# EAGLE design TT7B v1.0 (EAGLE 7.7.0)
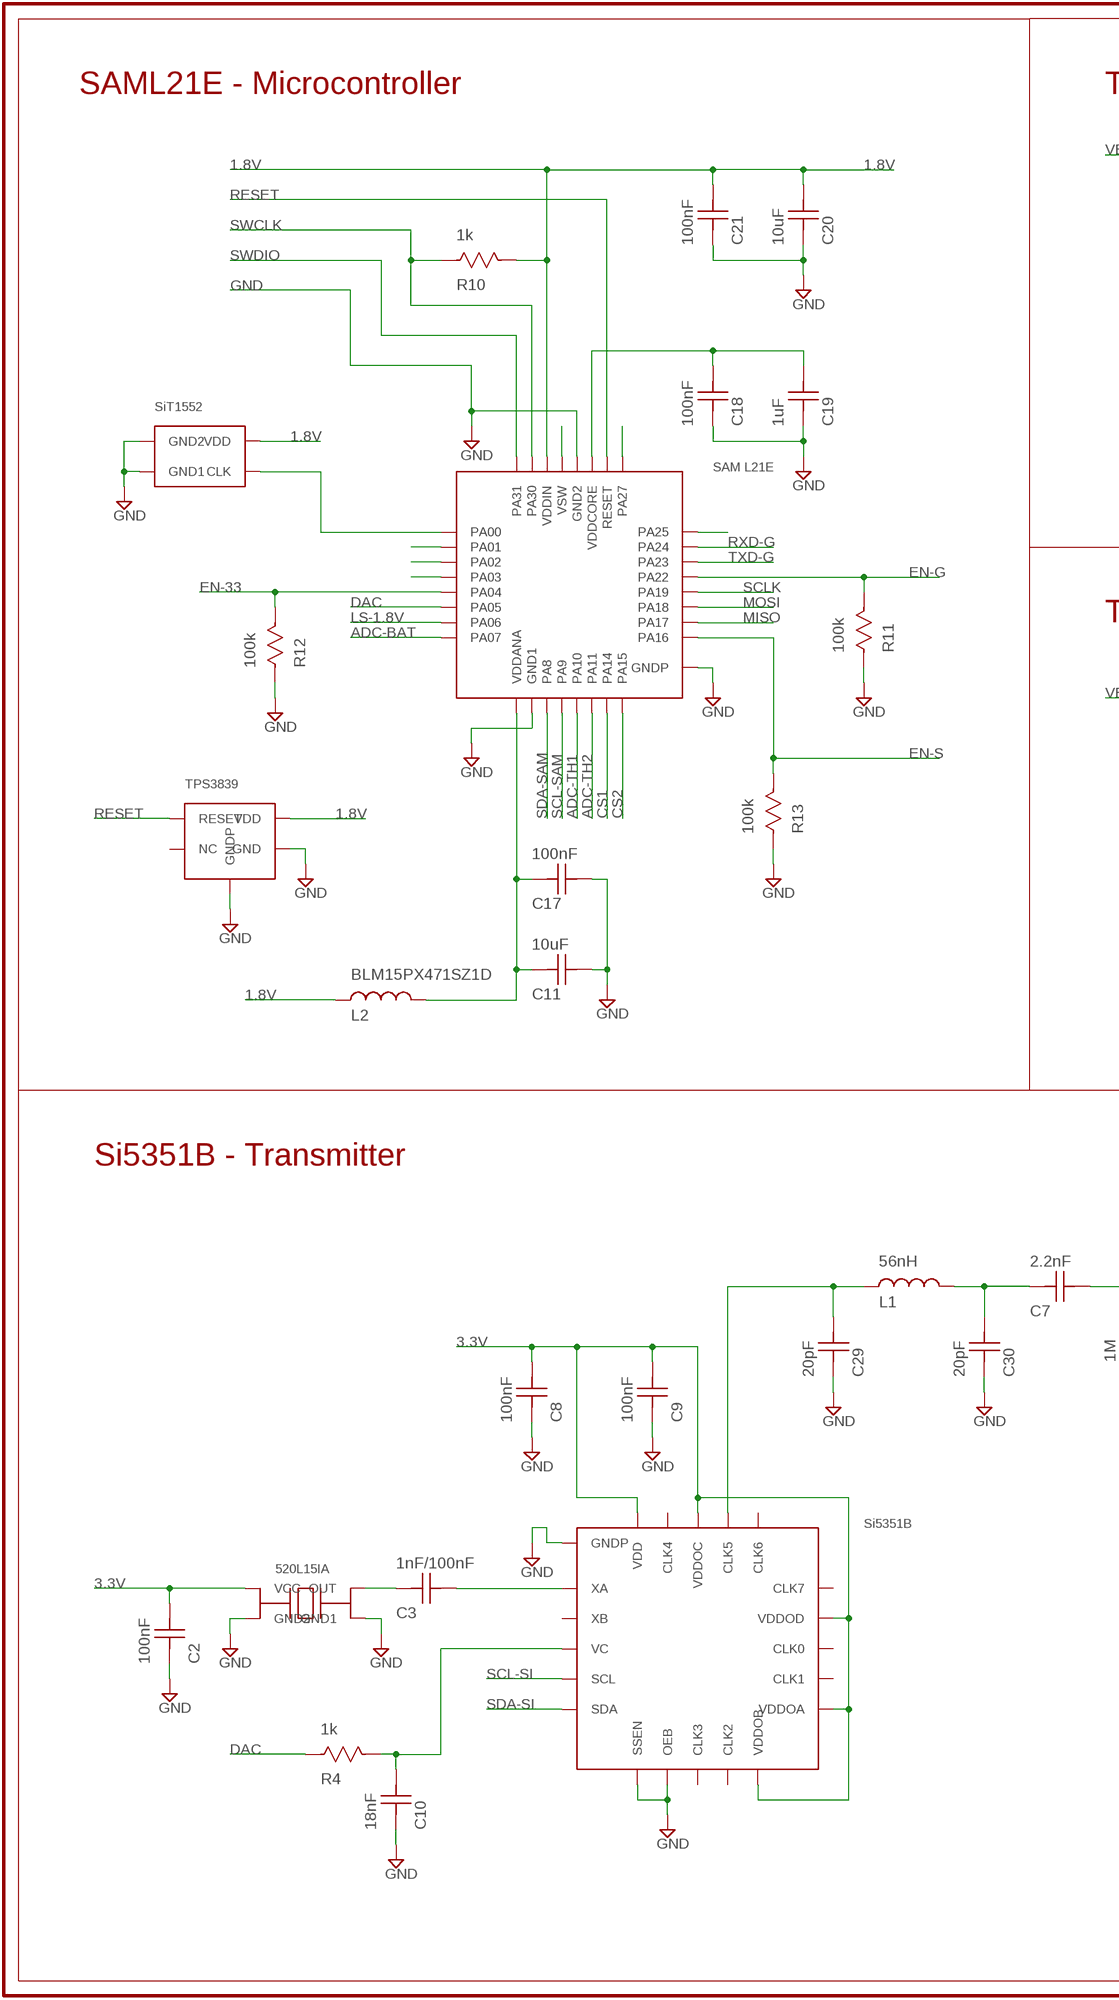
[diagram p0: schematic, sheet 1, part 1 of 2]
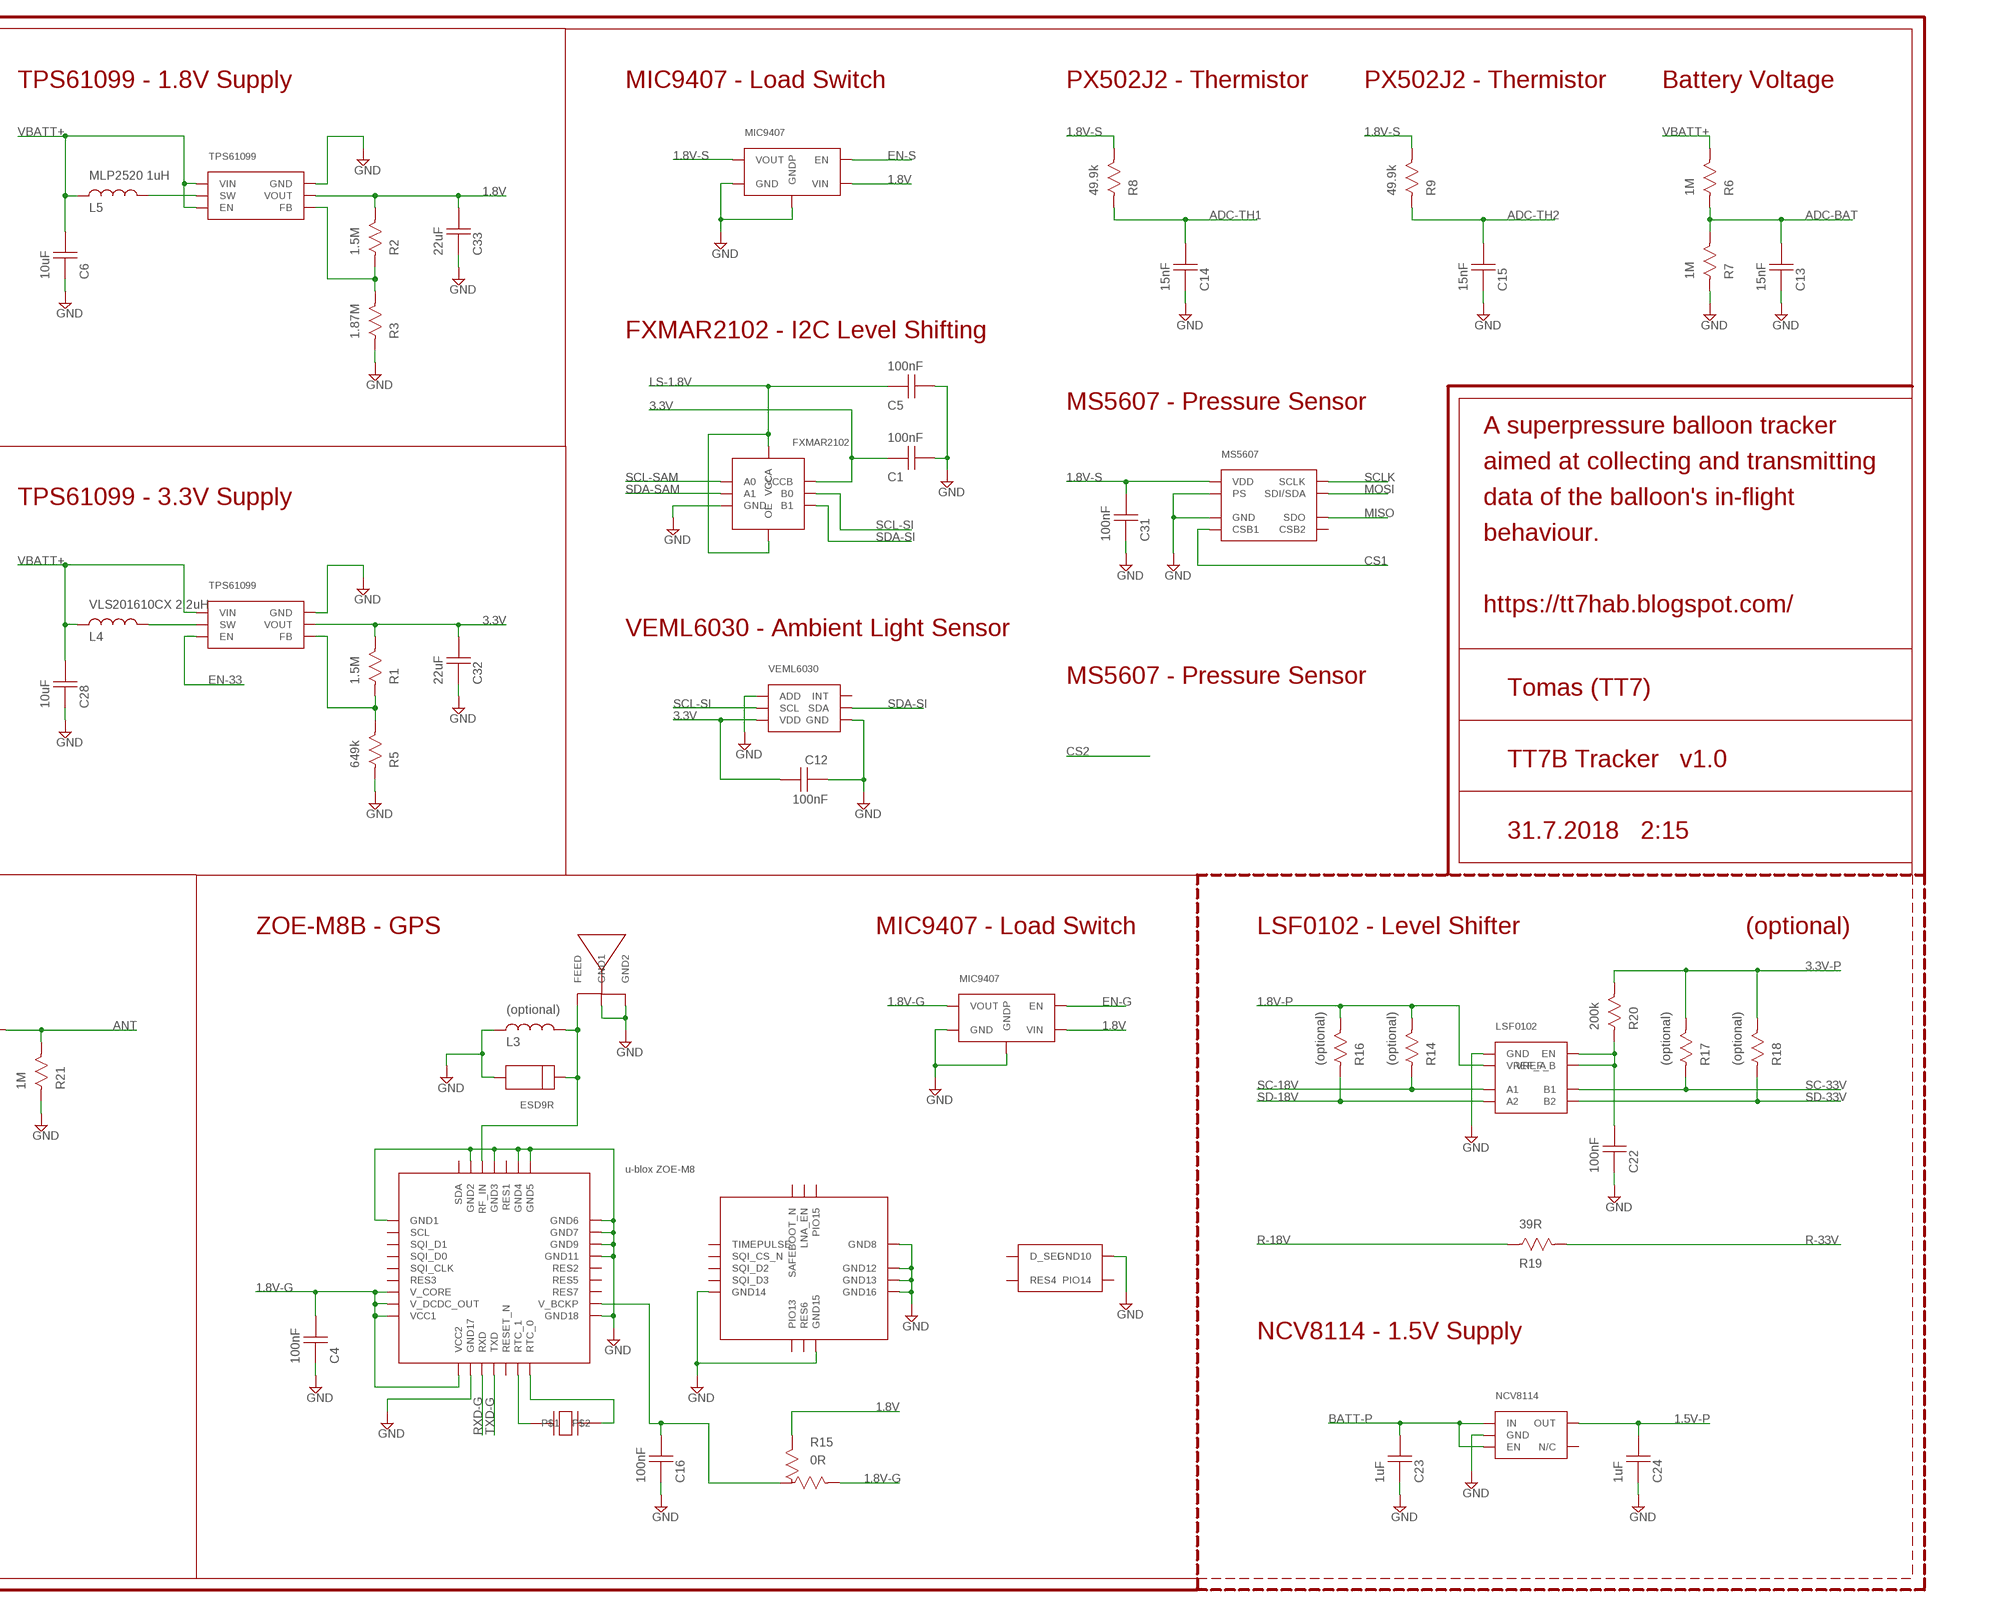
[diagram p1: schematic, sheet 1, part 2 of 2]

## Parts
C1  100nF  CAP0402  [CAP0402]
C2  100nF  CAP0402  [CAP0402]
C3  1nF/100nF  CAP0402  [CAP0402]
C4  100nF  CAP0402  [CAP0402]
C5  100nF  CAP0402  [CAP0402]
C6  10uF  CAP0402  [CAP0402]
C7  2.2nF  CAP0402  [CAP0402]
C8  100nF  CAP0402  [CAP0402]
C9  100nF  CAP0402  [CAP0402]
C10  18nF  CAP0402  [CAP0402]
C11  10uF  CAP0402  [CAP0402]
C12  100nF  CAP0402  [CAP0402]
C13  15nF  CAP0402  [CAP0402]
C14  15nF  CAP0402  [CAP0402]
C15  15nF  CAP0402  [CAP0402]
C16  100nF  CAP0402  [CAP0402]
C17  100nF  CAP0402  [CAP0402]
C18  100nF  CAP0402  [CAP0402]
C19  1uF  CAP0402  [CAP0402]
C20  10uF  CAP0402  [CAP0402]
C21  100nF  CAP0402  [CAP0402]
C22  100nF  CAP0402  [CAP0402]
C23  1uF  CAP0402  [CAP0402]
C24  1uF  CAP0402  [CAP0402]
C28  10uF  CAP0402  [CAP0402]
C29  20pF  CAP0402  [CAP0402]
C30  20pF  CAP0402  [CAP0402]
C31  100nF  CAP0402  [CAP0402]
C32  22uF  CAP0603  [CAP0603]
C33  22uF  CAP0603  [CAP0603]
D1  ESD9R  [ESD9R]
L1  56nH  IND0402  [IND0402]
L2  BLM15PX471SZ1D  IND0402  [IND0402]
L3  (optional)  IND0402  [IND0402]
L4  VLS201610CX 2.2uH  VLS201610CX  [VLS201610CX]
L5  MLP2520 1uH  MLP2520  [MLP2520]
R1  1.5M  RES0402  [RES0402]
R2  1.5M  RES0402  [RES0402]
R3  1.87M  RES0402  [RES0402]
R4  1k  RES0402  [RES0402]
R5  649k  RES0402  [RES0402]
R6  1M  RES0402  [RES0402]
R7  1M  RES0402  [RES0402]
R8  49.9k  RES0402  [RES0402]
R9  49.9k  RES0402  [RES0402]
R10  1k  RES0402  [RES0402]
R11  100k  RES0402  [RES0402]
R12  100k  RES0402  [RES0402]
R13  100k  RES0402  [RES0402]
R14  (optional)  RES0402  [RES0402]
R15  0R  RES0402-3  [RES0402-3]
R16  (optional)  RES0402  [RES0402]
R17  (optional)  RES0402  [RES0402]
R18  (optional)  RES0402  [RES0402]
R19  39R  RES0402  [RES0402]
R20  200k  RES0402  [RES0402]
R21  1M  RES0402  [RES0402]
U1  SAML21E18B-MUT  [SAML21E18B-MUT]
U2  UBLOX_ZOE-M8  [UBLOX_ZOE-M8]
U3  FXMAR2102  [FXMAR2102]
U4  520L15IA  [520L15IA]
U5  CM8V-T1A  [CM8V-T1A]
U6  MIC9407  [MIC9407]
U7  MS5607  [MS5607]
U8  LSF0102  [LSF0102]
U9  NCV8114  [NCV8114]
U10  W3011A  [W3011A]
U11  SI5351B  [SI5351B]
U12  TPS3839  [TPS383]
U13  MIC9407  [MIC9407]
U14  SIT1552  [SIT1552]
U15  VEML6030  [VEML6030]
U16  TPS61099  [TPS61099]
U17  TPS61099  [TPS61099]

## Nets
1.5V-P: C24.P$2 U9.OUT
1.8V: C20.P$2 C21.P$2 C33.P$2 L2.P$1 R2.P$2 R10.P$2 R15.1 U1.VDDIN U6.VIN U12.VDD U13.VIN U14.VDD U16.VOUT
1.8V-G: C4.P$2 R15.3 U2.V_CORE U2.V_DCDC_OUT U2.VCC1 U2.VCC2 U6.VOUT
1.8V-P: R14.P$2 R16.P$2 U8.VREF_A
1.8V-S: C31.P$2 R8.P$2 R9.P$2 U7.VDD U13.VOUT
3.3V: C1.P$1 C2.P$2 C8.P$2 C9.P$2 C12.P$2 C32.P$2 R1.P$2 U3.VCCB U4.VCC U11.VDD U11.VDDOA U11.VDDOB U11.VDDOC U11.VDDOD U15.VDD U17.VOUT
3.3V-P: R17.P$2 R18.P$2 R20.P$2
ADC-BAT: C13.P$2 R6.P$1 R7.P$2 U1.PA07
ADC-TH1: C14.P$2 R8.P$1 U1.PA10
ADC-TH2: C15.P$2 R9.P$1 U1.PA11
ANT: C7.P$2 R21.P$2
BATT-P: C23.P$2 U9.EN U9.IN
CS1: U1.PA14 U7.CSB1
CS2: U1.PA15
DAC: R4.P$1 U1.PA05
EN-33: R12.P$2 U1.PA04 U17.EN
EN-G: R11.P$2 U1.PA22 U6.EN
EN-S: R13.P$2 U1.PA16 U13.EN
GND: C1.P$2 C2.P$1 C4.P$1 C5.P$2 C6.P$1 C8.P$1 C9.P$1 C10.P$1 C11.P$2 C12.P$1 C13.P$1 C14.P$1 C15.P$1 C16.P$1 C17.P$2 C18.P$1 C19.P$1 C20.P$1 C21.P$1 C22.P$1 C23.P$1 C24.P$1 C28.P$1 C29.P$1 C30.P$1 C31.P$1 C32.P$1 C33.P$1 D1.2 L3.P$1 R3.P$1 R5.P$1 R7.P$1 R11.P$1 R12.P$1 R13.P$1 R21.P$1 U1.GND1 U1.GND2 U1.GNDP U2.GND1 U2.GND2 U2.GND3 U2.GND4 U2.GND5 U2.GND6 U2.GND7 U2.GND8 U2.GND9 U2.GND10 U2.GND11 U2.GND12 U2.GND13 U2.GND14 U2.GND15 U2.GND16 U2.GND17 U2.GND18 U3.GND U4.GND1 U4.GND2 U6.GND U6.GNDP U7.GND U7.PS U8.GND U9.GND U10.GND1 U10.GND2 U11.GNDP U11.OEB U11.SSEN U12.GND U12.GNDP U13.GND U13.GNDP U14.GND1 U14.GND2 U15.ADD U15.GND U16.GND U17.GND
LS-1.8V: C5.P$1 U1.PA06 U3.OE U3.VCCA
MISO: U1.PA17 U7.SDO
MOSI: U1.PA18 U7.SDI/SDA
N$1: D1.1 L3.P$2 U2.RF_IN U10.FEED
N$9: U1.PA25
N$10: C3.P$2 U11.XA
N$11: U1.PA01
N$12: U1.PA02
N$13: U1.PA03
N$15: U2.RTC_1 U5.P$1
N$18: U2.RTC_0 U5.P$2
N$19: C16.P$2 R15.2 U2.V_BCKP
N$21: U1.VSW
N$23: C18.P$2 C19.P$2 U1.VDDCORE
N$24: C22.P$2 R20.P$1 U8.EN U8.VREF_B
N$25: U1.PA27
N$26: C11.P$1 C17.P$1 L2.P$2 U1.VDDANA
N$34: C7.P$1 C30.P$2 L1.P$2
N$35: R2.P$1 R3.P$2 U16.FB
N$36: R1.P$1 R5.P$2 U17.FB
N$38: L4.P$2 U17.SW
N$39: L5.P$2 U16.SW
N$41: C29.P$2 L1.P$1 U11.CLK5
N$42: C3.P$1 U4.OUT
N$49: C10.P$2 R4.P$2 U11.VC
R-18V: R19.P$1
R-33V: R19.P$2
RESET: U1.RESET U12.RESET
RXD-G: U1.PA24 U2.RXD
SC-18V: R14.P$1 U8.A1
SC-33V: R17.P$1 U8.B1
SCL-SAM: U1.PA09(PA9) U3.A0
SCL-SI: U3.B0 U11.SCL U15.SCL
SCLK: U1.PA19 U7.SCLK
SD-18V: R16.P$1 U8.A2
SD-33V: R18.P$1 U8.B2
SDA-SAM: U1.PA08(PA8) U3.A1
SDA-SI: U3.B1 U11.SDA U15.SDA
SWCLK: R10.P$1 U1.PA30
SWDIO: U1.PA31
TXD-G: U1.PA23 U2.TXD
VBATT+: C6.P$2 C28.P$2 L4.P$1 L5.P$1 R6.P$2 U16.EN U16.VIN U17.VIN
XIN32: U1.PA00 U14.CLK
Unconnected: U2.D_SEL U2.LNA_EN U2.PIO13 U2.PIO14 U2.PIO15 U2.RES1 U2.RES2 U2.RES3 U2.RES4 U2.RES5 U2.RES6 U2.RES7 U2.RESET_N U2.SAFEBOOT_N U2.SCL U2.SDA U2.SQI_CLK U2.SQI_CS_N U2.SQI_D0 U2.SQI_D1 U2.SQI_D2 U2.SQI_D3 U2.TIMEPULSE U7.CSB2 U9.N/C U11.CLK0 U11.CLK1 U11.CLK2 U11.CLK3 U11.CLK4 U11.CLK6 U11.CLK7 U11.XB U12.NC U15.INT

## Notes on the sheet
- SAML21E - Microcontroller | TPS61099 - 1.8V Supply | MIC9407 - Load Switch | PX502J2 - Thermistor | PX502J2 - Thermistor | Battery Voltage
- FXMAR2102 - I2C Level Shifting
- MS5607 - Pressure Sensor
- A superpressure balloon tracker
- aimed at collecting and transmitting
- TPS61099 - 3.3V Supply | data of the balloon's in-flight
- behaviour.
- https://tt7hab.blogspot.com/
- VEML6030 - Ambient Light Sensor
- MS5607 - Pressure Sensor
- Tomas (TT7)
- TT7B Tracker   v1.0
- 31.7.2018   2:15
- Si5351B - Transmitter | ZOE-M8B - GPS | MIC9407 - Load Switch | LSF0102 - Level Shifter | (optional)
- NCV8114 - 1.5V Supply

## Library data of the parts
C1-C24 C28-C31 = TT7:CAP0402: CAPACITOR 0402 - 1 x 0.5 x 0.35mm
C32 C33 = TT7:CAP0603: CAPACITOR 0603 - 1.55 x 0.85 x 0.45mm
D1 = TT7:ESD9R: ESD9R protection diode footprint.
L1-L3 = TT7:IND0402: INDUCTOR 0402 - 1 x 0.5 x 0.35mm
L4 = TT7:VLS201610CX: VLS201610CX inductor footprint.
L5 = TT7:MLP2520: MLP2520 inductor footprint.
R1-R14 R16-R21 = TT7:RES0402: RESISTOR 0402 - 1 x 0.5 x 0.35mm
R15 = TT7:RES0402-3: Resistor Switch.
U1 = TT7:SAML21E18B-MUT: Atmel's SAM L21E18B in a 32 pin QFN package.
U2 = TT7:UBLOX_ZOE-M8: U-blox ZOE-M8 footprint.
U3 = TT7:FXMAR2102: FXMAR2102 voltage translator in UMLP-8 package footprint.
U4 = TT7:520L15IA: 520L15IA TCXO footprint.
U5 = TT7:CM8V-T1A: CM8V-T1A 32.768kHz crystal footprint.
U6 U13 = TT7:MIC9407: MIC9407 load switch in MLF package footprint.
U7 = TT7:MS5607: MS5607 barometric pressure sensor footprint.
U8 = TT7:LSF0102: LSF0102 bidirectional level translator in VSSOP package (LSF0102DCUR).
U9 = TT7:NCV8114: NCV8114 LDO regulator footprint in TSOP-5 package.
U10 = TT7:W3011A: W3011A GPS chip antenna footprint.
U11 = TT7:SI5351B: Si5351B transmitter.
U12 = TT7:TPS3839: TPS3839 in X2SON-4 package footprint.
U14 = TT7:SIT1552: SiT1552 32kHz TCXO footprint.
U15 = TT7:VEML6030: VEML6030 ambient light sensor footprint.
U16 U17 = TT7:TPS61099: TPS61099 boost converter in DSBGA package footprint.

## Board
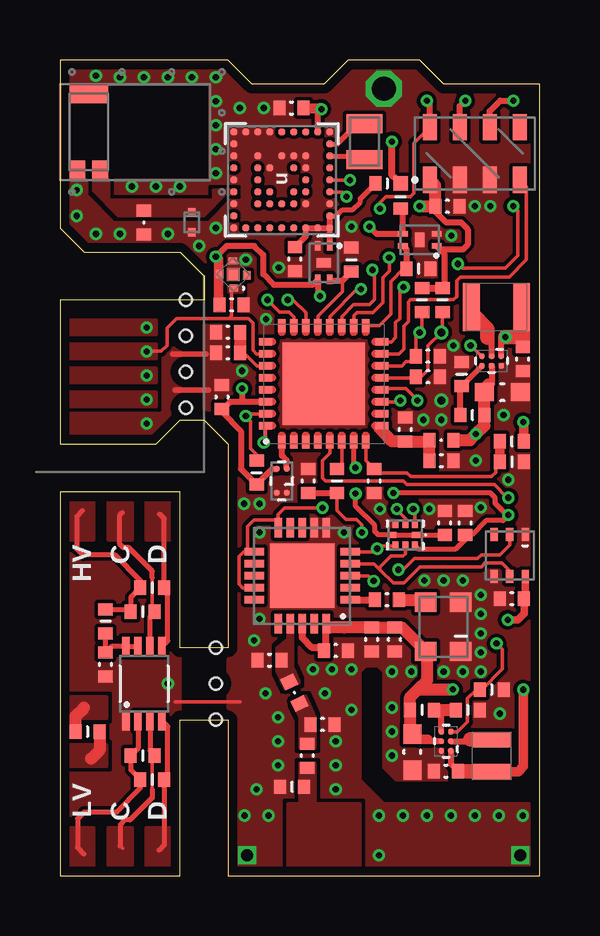
[diagram p2: board, top side]
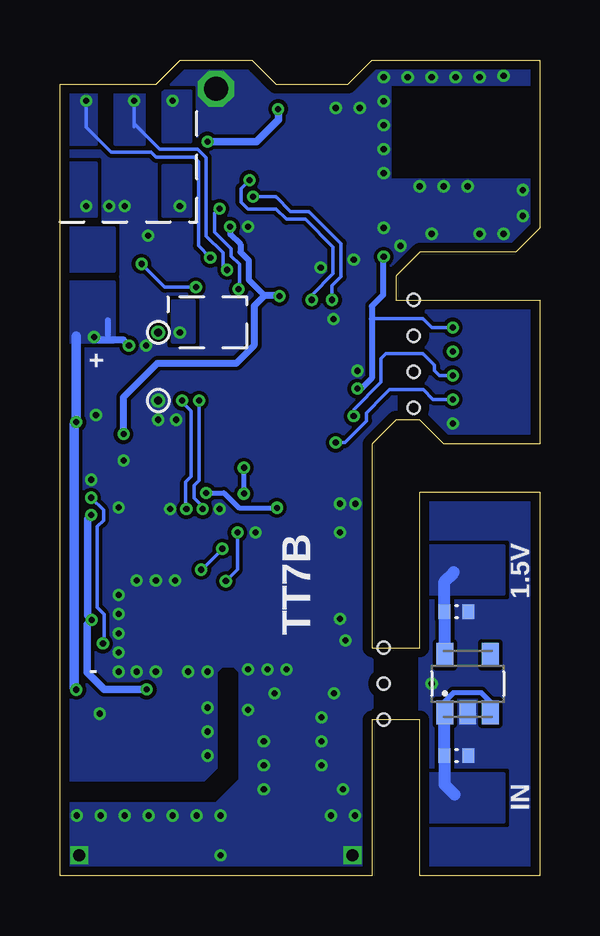
[diagram p3: board, bottom side, seen from below]

Size 20 x 34 mm. Coordinates in mm from the lower left corner, seen from the top.
Outline: 7,0 20,0 20,33 16,33 15,34 12,34 11,33 8,33 7,34 0,34 0,27 1,26 5,26 6,25 6,24 0,24 0,18 4,18 5,19 6,19 7,18 7,9.5 5,9.5 5,16 0,16 0,0 5,0 5,6.5 7,6.5 7,0
Copper layers (1*16): Top 0.035559375mm / dielectric 1.6mm / Bottom 0.035559375mm
Design rules "oshpark-2layer *": minimum track width 6mil, minimum drill 10mil, track to track 6mil, track to pad 6mil, pad to pad 6mil, via to via 6mil, smd to smd 0mil, copper to edge 15mil, drill to drill 6mil, minimum pad ring 5mil, minimum via ring 5mil, stop-mask expansion 0mil, vias tented up to drill 20mil, thermal gap 10mil
Holes 0.51 mm at 5.25,19.5 5.25,21 5.25,22.5 5.25,24 6.5,9.5 6.5,8 6.5,6.5

### Footprints (pad centres in the part's own frame; a part is rotated, then mirrored left to right if it is on the bottom)
CAP0402 = smd 0.5 x 0.6: P$1 -0.5,0; P$2 0.5,0
CAP0603 = smd 0.8 x 0.75: P$1 -0.75,0; P$2 0.75,0
ESD9R = smd 0.36 x 0.3: 1 -0.42,0; 2 0.42,0
IND0402 = smd 0.5 x 0.6: P$1 -0.5,0; P$2 0.5,0
VLS201610CX = smd 0.65 x 1.6: P$1 -0.675,0; P$2 0.675,0
MLP2520 = smd 0.7 x 2: P$1 -1.05,0; P$2 1.05,0
RES0402 = smd 0.5 x 0.6: P$1 -0.5,0; P$2 0.5,0
RES0402-3 = smd 0.6 x 0.5: 1 -0.55,1.05 | smd 0.6 x 0.6: 2 -0.55,0 | smd 0.5 x 0.6: 3 0.5,0
SAML21E18B-MUT = smd 0.3 x 0.55: GND1 -1.25,-2.425; GND2 0.25,2.425; PA08 -0.75,-2.425; PA09 -0.25,-2.425; PA10 0.25,-2.425; PA11 0.75,-2.425; PA14 1.25,-2.425; PA15 1.75,-2.425; PA27 1.75,2.425; PA30 -1.25,2.425; PA31 -1.75,2.425; RESET 1.25,2.425; VDDANA -1.75,-2.425; VDDCORE 0.75,2.425; VDDIN -0.75,2.425; VSW -0.25,2.425 | smd 3.45 x 3.45: GNDP 0,0 | smd 0.55 x 0.3: PA00 -2.425,1.75; PA01 -2.425,1.25; PA02 -2.425,0.75; PA03 -2.425,0.25; PA04 -2.425,-0.25; PA05 -2.425,-0.75; PA06 -2.425,-1.25; PA07 -2.425,-1.75; PA16 2.425,-1.75; PA17 2.425,-1.25; PA18 2.425,-0.75; PA19 2.425,-0.25; PA22 2.425,0.25; PA23 2.425,0.75; PA24 2.425,1.25; PA25 2.425,1.75
UBLOX_ZOE-M8 = smd 0.27 x 0.27: D_SEL -0.5,0.5; GND1 -2,2; GND2 -1,2; GND3 0,2; GND4 1,2; GND5 1.5,2; GND6 2,2; GND7 2,1.5; GND8 1,1; GND9 2,1; GND10 0.5,0.5; GND11 2,0.5; GND12 1,0; GND13 1,-0.5; GND14 -1,-1; GND15 0.5,-1; GND16 1,-1; GND17 -1,-2; GND18 2,-2; LNA_EN 0,1; PIO13 -0.5,-1; PIO14 0.5,-0.5; PIO15 0.5,1; RES1 0.5,2; RES2 2,0; RES3 -2,-0.5; RES4 -0.5,-0.5; RES5 2,-0.5; RES6 0,-1; RES7 2,-1; RESET_N 0.5,-2; RF_IN -0.5,2; RTC_0 1.5,-2; RTC_1 1,-2; RXD -0.5,-2; SAFEBOOT_N -0.5,1; SCL -2,1.5; SDA -1.5,2; SQI_CLK -2,0; SQI_CS_N -1,0.5; SQI_D0 -2,0.5; SQI_D1 -2,1; SQI_D2 -1,0; SQI_D3 -1,-0.5; TIMEPULSE -1,1; TXD 0,-2; V_BCKP 2,-1.5; V_CORE -2,-1; V_DCDC_OUT -2,-1.5; VCC1 -2,-2; VCC2 -1.5,-2
FXMAR2102 = smd 0.25 x 0.35: A0 -0.405,-0.455; A1 0,-0.455; B0 0,0.455; B1 0.405,0.455; GND 0.405,-0.455; VCCB -0.405,0.455 | smd 0.35 x 0.25: OE 0.55,0 | smd 0.45 x 0.25: VCCA -0.5,0
520L15IA = smd 0.8 x 0.9: GND1 1.025,-0.725; GND2 -1.025,-0.725; OUT 1.025,0.725; VCC -1.025,0.725
CM8V-T1A = smd 0.8 x 1.5: P$1 -0.75,0; P$2 0.75,0
MIC9407 = smd 0.23 x 0.4: EN -0.25,0.7; GND 0.25,-0.7; VIN 0.25,0.7; VOUT -0.25,-0.7 | smd 0.6 x 0.4: GNDP 0,0
MS5607 = smd 1.1 x 0.6: CSB1 -1.1,-1.875; CSB2 1.1,-1.875; GND -1.1,-0.625; PS -1.1,0.625; SCLK 1.1,1.875; SDI/SDA 1.1,0.625; SDO 1.1,-0.625; VDD -1.1,1.875
LSF0102 = smd 0.3 x 0.8: A1 0.25,-1.55; A2 0.75,-1.55; B1 0.25,1.55; B2 0.75,1.55; EN -0.75,1.55; GND -0.75,-1.55; VREF_A -0.25,-1.55; VREF_B -0.25,1.55
NCV8114 = smd 0.7 x 1: EN -0.95,1.2; GND 0,1.2; IN 0.95,1.2; N/C -0.95,-1.2; OUT 0.95,-1.2
W3011A = smd 0.65 x 0.8: FEED -1.325,-1.6; GND2 -2.275,-1.6 | smd 1.6 x 0.8: GND1 -1.8,1.6
SI5351B = smd 0.8 x 0.3: CLK0 2,0; CLK1 2,-0.5; CLK7 2,1; SCL -2,-0.5; SDA -2,-1; VC -2,0; VDDOA 2,-1; VDDOD 2,0.5; XA -2,1; XB -2,0.5 | smd 0.3 x 0.8: CLK2 0.5,-2; CLK3 0,-2; CLK4 -0.5,2; CLK5 0.5,2; CLK6 1,2; OEB -0.5,-2; SSEN -1,-2; VDD -1,2; VDDOB 1,-2; VDDOC 0,2 | smd 2.7 x 2.7: GNDP 0,0
TPS383 = smd 0.35 x 0.3 rotated 45: GND 0.42,-0.38; RESET -0.42,0.38 | smd 0.53 x 0.53 rotated 45: GNDP 0,0 | smd 0.3 x 0.35 rotated 45: NC -0.42,-0.38; VDD 0.42,0.38
SIT1552 = smd 0.25 x 0.25: CLK 0.5,-0.205; GND1 -0.5,-0.205; GND2 -0.5,0.205; VDD 0.5,0.205
VEML6030 = smd 0.55 x 0.3: ADD -0.875,0.65; GND 0.875,-0.65; INT 0.875,0.65; SCL -0.875,0; SDA 0.875,0; VDD -0.875,-0.65
TPS61099 = smd 0.23 x 0.23: EN -0.2,-0.4; FB 0.2,-0.4; GND 0.2,0.4; SW -0.2,0; VIN -0.2,0.4; VOUT 0.2,0

### Placement (x,y rotation side)
C1  16.9,14.7 90 top
C2  13.95,9.84 90 top
C3  13.63,11.5 180 top
C4  9.8,25.7 90 top
C5  16.05,14.7 90 top
C6  19.3,21.53 90 top
C7  10.31,5 270 top
C8  11.5,9.38 180 top
C9  13,9.84 90 top
C10  10.35,16.45 270 top
C11  15.9,17.3 0 top
C12  18.85,11.55 0 top
C13  13.11,16.45 90 top
C14  15.35,20.8 180 top
C15  15.35,21.65 180 top
C16  9.65,32 0 top
C17  14.4,18.6 90 top
C18  7,21.8 0 top
C19  7,22.65 0 top
C20  7.16,23.79 180 top
C21  6.75,19.95 270 top
C22  1.9,8.8 90 top
C23  3.46,5 180 bottom
C24  3.46,11 180 bottom
C28  16.1,4.35 0 top
C29  8.73,8.97 0 top
C30  10.95,6.3 180 top
C31  16.15,27.9 180 top
C32  14.7,5.15 90 top
C33  18.45,20.15 180 top
D1  5.5,27.23 270 top
L1  9.78,7.62 295.5 top
L2  15.9,18.15 180 top
L3  3.5,27.22 90 top
L4  18,5 90 top
L5  18.2,23.7 180 top
R1  15.1,6.9 180 top
R2  17.2,19.2 0 top
R3  16.75,20.9 270 top
R4  1kΩ  [RES0402]  11.55,16.45 270 top
R5  17,6.9 180 top
R6  18.85,18.1 0 top
R7  18.85,17.25 180 top
R8  15.95,24 90 top
R9  15.1,24 90 top
R10  8.2,16.8 270 top
R11  12.15,25.68 270 top
R12  18,7.75 180 top
R13  14.95,25.3 180 top
R14  3.45,5 180 top
R15  0Ω  [RES0402-3]  13.65,28.85 180 top
R16  3.85,4 180 top
R17  3.45,11 180 top
R18  3.85,12 180 top
R19  1.15,6 180 top
R20  1.9,10.6 90 top
R21  1MΩ  [RES0402]  9.68,3.7 0 top
U1  11,20.5 90 top
U2  9.25,29 90 top
U3  14.4,14.2 180 top
U4  15.98,10.38 90 top
U5  12.7,30.6 90 top
U6  11,25.55 180 top
U7  17.3,30.1 90 top
U8  3.5,8 0 top
U9  3,8 180 bottom
U10  3,31 0 top
U11  10.1,12.5 180 top
U12  7.23,25.05 135 top
U13  15,26.5 90 top
U14  9.25,16.45 90 top
U15  18.75,13.35 90 top
U16  18,21.45 270 top
U17  16.1,5.6 180 top

### Tracks (layer width: path | path; a pad name or v marks a point on that pad's centre or on a via)
1.5V-P
  Bottom 0.5: U9.OUT C24.P$2 3.96,12.26 3.58,12.64
  pour Bottom (no thermals): 5,11.75 1.5,11.75 1.5,13.75 5,13.75
1.8V  (via drill 0.25 pad 0.25)
  Top 0.152: 6.61,25.03 U12.VDD
  Top 0.24: U16.VOUT 18,20.45 C33.P$2 | R15.1 14.3,27.7 U13.VIN 13.2,26.75 v12.9,27.05 | v10.85,24.15 10.75,24.25 U6.VIN 10.52,24.62 8.92,24.62 8.48,25.07 8.48,25.87 8.1,26.25 6.95,26.25 v6.5,25.8
  Top 0.25: U1.VDDIN 7.59,19.75 | 7.59,19.75 7.1,19.75 6.8,19.45 C21.P$2 | 6.8,19.4 C21.P$2 | v7.6,20.3 7.6,19.76 7.59,19.75 | U14.VDD 8.85,16.95 R10.P$2 7.55,16.95 7.55,18.51 6.75,19.31 C21.P$2
  Top 0.39: 6.61,23.83 6.61,25.03 6.61,25.69 v6.5,25.8
  Top 0.4: C20.P$2 6.61,23.83
  Top 0.5: L2.P$1 17.1,18.15 v17.35,18.4 17.7,18.75 R2.P$2 C33.P$2 17.87,20.48
  Bottom 0.152: v3.62,22.85 4.49,22.85 4.86,23.22 6.99,23.22
  Bottom 0.24: v12.9,27.05 12.9,26.74 12.48,26.31 12.48,25.99 12.13,25.65 12.13,24.84 11.5,24.21 11.5,24.15
  Bottom 0.25: v7.6,20.3 7.43,20.3 6.99,20.73 6.99,23.22 6.99,23.73 6.52,24.2 6.52,25.78 v6.5,25.8
  Bottom 0.3: v17.35,18.4 17.35,19.95 15.94,21.36 12.64,21.36 11.89,22.12 11.89,23.76 11.5,24.15 | 11.5,24.21 10.91,24.21 v10.85,24.15
  pour Top: 0,23.15 4,23.15 4,22.55 0,22.55
1.8V-G
  Top 0.2: U2.VCC2 11.54,27.5 11.79,27.75 12.2,27.75 12.52,28.08 12.52,28.22 R15.3
  Top 0.24: U6.VOUT U2.VCC1 | C4.P$2 10.25,26.65 U2.V_CORE
  Top 0.25: U2.V_CORE U2.V_DCDC_OUT U2.VCC1 U2.VCC2
1.8V-P
  Top 0.2: U8.VREF_A 3.25,5.3 R14.P$2 2.95,4.4 R16.P$2 3.35,3.65 2.35,2.65 1.01,2.65 0.73,2.37 0.73,1.16 1,0.89
  pour Top (no thermals): 0,2 1.4,2 1.4,0 0,0
1.8V-S  (via drill 0.25 pad 0.25)
  Top 0.24: C31.P$2 15.65,27.68 16.1,27.23 16.72,27.23 17.01,26.94 17.01,26.3 16.81,26.1 15.85,26.1 U13.VOUT 16.05,25.91 16.05,24.59 R8.P$2
  Top 0.3: R9.P$2 R8.P$2
  Top 0.5: U7.VDD 15.65,28.77 C31.P$2 v15,27.9
  pour Bottom (no thermals): 14.55,29.6 15.7,29.6 15.7,27.5 14.55,27.5
3.3V  (via drill 0.25 pad 0.25)
  Top 0.152: U11.VDDOD 7.62,12 7.46,12.16 7.46,13.31 7.65,13.5 U11.VDDOA 7.82,13.5 7.82,14.54 8.09,14.81 9.1,14.81 | 9.1,14.81 U11.VDDOB | 9.1,14.81 9.1,15.06 9.37,15.33 v10.95,15.33
  Top 0.2: U3.VCCB 14.93,13.62 16.5,13.62 16.9,14.02 C1.P$1 17.17,14.2 17.77,14.8 18.47,14.8 v18.7,15.03 18.64,15.03 18.15,15.51 18.15,15.74 17.94,15.95 v13.9,15.95
  Top 0.24: U17.VOUT 15.41,5.6
  Top 0.25: 15.41,5.6 15.34,5.68
  Top 0.3: 11.26,10.34 U11.VDD 11.1,9.48 arc-90 C8.P$2 10.86,9.52 10.5,9.52 10.1,9.92 U11.VDDOC
  Top 0.305: v18.67,10.66 19.09,10.66 19.36,10.93 19.36,11.54 C12.P$2 19.4,11.6 U15.VDD
  Top 0.4: C32.P$2 14.92,5.68 15.34,5.68
  Top 0.5: C32.P$2 14.6,6 R1.P$2 14.6,7.43 14.93,7.76 | 14.93,7.76 15.31,8.14 15.31,9.29 U4.VCC 14.27,10.34 C2.P$2 C9.P$2 11.86,10.34 11.26,10.34 | 14.93,7.76 v16.39,7.76
  Bottom 0.2: v13.9,15.95 13.16,15.95 12.54,15.33 v10.95,15.33
  Bottom 0.305: v16.39,7.76 18.16,7.76 18.86,8.46 18.86,10.47 v18.67,10.66 18.85,10.84 18.85,14.87 v18.7,15.03
3.3V-P
  Top 0.2: R20.P$2 2.85,11.1 R17.P$2 2.95,11.6 R18.P$2 3.35,12.31 2.3,13.36 0.96,13.36 0.71,13.61 0.71,14.98 0.95,15.21
  pour Top (no thermals): 1.4,14 1.4,16 0,16 0,14
ADC-BAT
  Top 0.152: U1.PA07 12.75,17.31 C13.P$2 13.27,16.79 14.48,16.79 14.64,16.63 18,16.63 18.18,16.81 18.18,17.12 R7.P$2
  Top 0.4: R7.P$2 R6.P$1
ADC-TH1  (via drill 0.33 pad 0.33)
  Top 0.152: U1.PA10 14.8,20.75 C14.P$2 15.08,20.8 15.35,21.07 15.35,22.09 v15.9,22.64 15.95,22.69 R8.P$1
ADC-TH2  (via drill 0.25 pad 0.25)
  Top 0.152: U1.PA11 14.25,21.25 14.42,21.42 14.62,21.42 C15.P$2 14.85,22.49 v15,22.64 15.1,22.74 R9.P$1
  pour Bottom (no thermals): 14.4,22.25 14.4,23.94 15.3,23.94 15.3,22.25
ANT
  pour Top (no thermals): 10,4.67 10.63,4.67 10.63,3 12.5,3 12.5,0 9.5,0 9.5,3 10,3
BATT-P
  Bottom 0.2: U9.EN 2.05,7.25 2.43,7.62 3.6,7.62 3.95,7.27 U9.IN
  Bottom 0.5: U9.IN C23.P$2 3.96,3.8 3.54,3.37
  pour Bottom: 5,4.25 1.5,4.25 1.5,2.25 5,2.25
CS1
  Top 0.152: U1.PA14 14.14,21.75 14.34,21.95 14.34,22.9 14.53,23.09 14.53,23.91 14.62,24 16.41,24 16.55,24.13 16.55,24.8 16.7,24.95 18.73,24.95 19.46,25.68 19.46,28.72 U7.CSB1
CS2  (via drill 0.25 pad 0.25)
  Top 0.152: U1.PA15 13.82,22.25 13.98,22.42 13.98,23.04 14.17,23.23 14.17,24.37 v14.33,24.53 | v18.9,27.9 19.09,27.71 19.09,25.83 18.58,25.32 16.77,25.32 v16.6,25.5
  Bottom 0.152: v14.33,24.53 15.63,24.53 v16.6,25.5
  pour Bottom (no thermals): 18.5,29.7 19.7,29.7 19.7,27.5 18.5,27.5
DAC
  Top 0.152: U1.PA05 11.75,16.95 R4.P$1
EN-33  (via drill 0.25 pad 0.25)
  Top 0.152: U17.EN 16.58,6 16.99,6.41 16.99,7.38 17.36,7.75 R12.P$2 17.59,7.75 18.46,8.62 18.46,9.43 v18.21,9.68 | U1.PA04 11.25,17.61 10.94,17.3 10.94,16.58 11.07,16.45 14.32,16.45 14.48,16.29 18.12,16.29 18.66,15.75 v18.7,15.75
  Bottom 0.152: v18.21,9.68 18.16,9.72 18.16,10.88 18.45,11.17 18.45,14.55 18.19,14.81 18.19,15.24 v18.7,15.75 | v18.7,15.75
EN-G
  Top 0.152: U1.PA22 10.75,23.32 11.77,24.34 11.77,24.8 | 11.3,24.8 U6.EN
  Top 0.24: 11.3,24.8 11.77,24.8 R11.P$2
EN-S
  Top 0.152: U1.PA16 13.32,22.93 13.8,23.4 13.8,24.77 14.32,25.3 R13.P$2
  Top 0.24: U13.EN 14.45,26.1 R13.P$2
GND  (via drill 0.25, 0.33, 0.5, 1)
  Top 0.152: 4.8,7.25 7.5,7.25
  Top 0.22: 6.2,20.25 4.8,20.25 | 6.1,21.75 4.7,21.75
  other vias: 4.5,26.75 2.5,26.75 4.5,33.28 6.5,33.28 1.5,33.35 2.5,33.28 0.7,28.58 3,28.73 5,28.73 6.5,31.28 6.5,32.28 0.7,27.5 6.5,27 15.9,19.8 13.5,32.8 7.8,0.85 8.32,14.3 8.32,10.7 3.62,18.85 1.5,26.75 4,28.73 7.5,32 6.5,30.28 3.5,33.28 5.5,33.28 6.5,29.28 17.55,9.3 17.55,10.9 17.55,11.7 17.55,10.1 13.85,5 8.7,2.5 16.8,8.5 13.85,8.5 8.2,3.6 9.1,4.6 9.1,5.6 9.1,6.6 19.2,0.85 7.7,2.5 19.3,2.5 18.3,2.5 17.3,2.5 16.3,2.5 15.3,2.5 14.3,2.5 13.3,2.5 13.3,0.85 11.5,3.6 11.5,4.6 11.5,5.6 12.15,6.9 8.57,7.6 8.1,9.8 11.05,7.6 10.55,8.6 12.15,8.6 11.35,8.6 14.65,8.5 16,8.5 17.55,8.5 13.85,6 13.85,7 8.5,32 17.3,27.9 16.8,12.3 16,12.3 15.2,12.3 7.67,15.5 8.32,15.5 11.85,14.3 18.35,6.75 18.7,16.5 13.35,15.28 17.55,15.35 9.12,25.35 15.15,19 7.6,21.04 18.5,19.2 15.4,15.28 17.35,17.3 5.8,26.25 16.32,26.68 12.15,27.05 15.9,19 17.95,27.9 16.41,22.1 7.75,25.68 8.6,23.2 4.5,8
  pour Top (rank 2, no thermals): 7.5,25 0,25 0,29 6.25,29 6.25,33 0,33 0,34 7.5,34
  pour Bottom (rank 2, no thermals): 7.5,25 0,25 0,29 6.25,29 6.25,33 0,33 0,34 7.5,34
  pour Top (rank 2, no thermals): 7,0 20,0 20,3 13.5,3 12.5,4 12.5,8.5 12.75,8.75 13.25,8.75 13.5,8.5 13.5,4.5 14,4 20,4 20,33 16,33 15,34 12,34 11,33 8,33 7,34 7,26 6,26 6,18 7,18
  pour Bottom (rank 2, no thermals): 7,0 20,0 20,3 13.5,3 12.5,4 12.5,8.5 12.75,8.75 13.25,8.75 13.5,8.5 13.5,4.5 14,4 20,4 20,33 16,33 15,34 12,34 11,33 8,33 7,34 7,26 6,26 6,18 7,18
  pour Top (rank 2, no thermals): 5,18 0,18 0,24 5,24
  pour Bottom (rank 2, no thermals): 0,18 0,24 5,24 5,18
  pour Bottom (rank 2, no thermals): 5,0 5,16 0,16 0,0
  pour Top (rank 2, no thermals): 0,0 5,0 5,16 0,16
LS-1.8V  (via drill 0.25 pad 0.25)
  Top 0.2: C5.P$1 U3.VCCA U3.OE 13.27,14.2 13.13,14.35 13.13,14.59 12.33,15.39 v12.33,15.92 | v12.33,17 12.25,17.08 U1.PA06
  Bottom 0.2: v12.33,15.92 v12.33,17
MISO  (via drill 0.25 pad 0.25)
  Top 0.152: v13.73,25.76 13.73,25.19 13.46,24.92 13.46,23.88 13.05,23.47 12.38,23.47 12.25,23.34 U1.PA17
  Top 0.25: U7.SDO 17.93,31.87 18.36,32.31 v18.89,32.31 v18.9,32.3
  Bottom 0.152: v18.9,32.3 18.9,31.2 17.86,30.16 16.2,30.16 15.98,29.94 14.41,29.94 14.23,29.75 14.23,26.26 v13.73,25.76
  pour Bottom (no thermals): 18.5,32.7 19.7,32.7 19.7,30.5 18.5,30.5
MOSI  (via drill 0.25 pad 0.25)
  Top 0.152: v13.03,25.25 13.12,25.16 13.12,24.02 12.9,23.8 12.24,23.8 11.75,23.31 U1.PA18
  Top 0.25: U7.SDI/SDA 16.68,32.08 v16.9,32.3
  Bottom 0.152: 16.9,31.22 v16.9,32.3 16.9,31.34 15.83,30.27 14.26,30.27 13.9,29.92 13.9,26.67 13.21,25.97 13.21,25.43 v13.03,25.25
  pour Bottom (no thermals): 17.7,32.7 17.7,30.5 16.5,30.5 16.5,32.7
N$1
  pour Top (no thermals): 2.43,27.52 6,27.52 6.9,28.43 6.7,28.57 6.4,28.57 6.4,28.16 2.05,28.16 1.98,28.55 1.4,28.55
  pour Top: 1.4,28.55 1.4,29 2.04,29 2.04,28.15
  pour Top: 6.5,28.57 7.33,28.57 7.33,28.43 6.5,28.43
N$10
  Top 0.3: U11.XA C3.P$2
N$15
  Top 0.2: U2.RTC_1 12.55,30 U5.P$1
N$18
  Top 0.2: U2.RTC_0 11.55,30.5 12.07,31.02 U5.P$2
N$19  (via drill 0.25 pad 0.25)
  Top 0.25: U2.V_BCKP 10.75,31.8 v10.9,31.95
  Top 0.3: 14.05,29 13.85,29.2 v13.85,30.6
  Top 0.305: R15.2 14.05,29
  Top 0.406: C16.P$2 10.85,32 v10.9,31.95
  Bottom 0.2: 10.89,31.94 v10.9,31.95
  Bottom 0.305: v13.85,30.6 11.8,30.6 10.89,31.51 10.89,31.94
N$23
  Top 0.152: U1.VDDCORE 8.21,21.25 7.66,21.8 C18.P$2
  Top 0.5: C19.P$2 C18.P$2
N$24
  Top 0.2: U8.VREF_B U8.EN 2.15,9.55 C22.P$2 R20.P$1
N$26
  Top 0.2: U1.VDDANA 13.34,18.64
  Top 0.5: C11.P$1 L2.P$2 15.35,18.1 C17.P$1 13.85,18.1 13.34,18.64
N$34
  pour Top (no thermals): 9.69,7.25 10.23,7.49 10.63,6.6 10.63,5.32 10,5.32 10,6.6
N$35
  Top 0.2: U16.FB R3.P$2
  Top 0.25: R2.P$1 16.7,20.35 R3.P$2
N$36
  Top 0.24: U17.FB 15.9,6.6
  Top 0.25: 15.9,6.6 R1.P$1
  Top 0.5: R1.P$1 R5.P$2
N$38
  Top 0.24: U17.SW 17.12,5.6
  Top 0.25: 17.12,5.6 17.12,5.68 | L4.P$2
  Top 0.6: 17.12,5.68 L4.P$2
N$39
  Top 0.24: U16.SW 18,22.4 17.98,22.42 17.82,22.43
  Top 0.6: L5.P$2 17.15,23.46 17.82,22.78 17.82,22.43
N$41
  pour Top (no thermals): 9.05,9.5 9.51,9.87 9.51,10.2 9.69,10.2 9.69,8.71 9.99,8.05 9.41,7.78 9.05,8.54
N$42
  Top 0.5: C3.P$1 15.15,11.5 U4.OUT
N$49  (via drill 0.25 pad 0.25)
  Top 0.152: U11.VC 12.86,12.5 v13.08,12.27 | v12.6,14.3 12.6,14.61 12.37,14.85 11.92,14.85 11.55,15.22 R4.P$2
  Top 0.25: C10.P$2 R4.P$2
  Bottom 0.152: v13.08,12.27 12.6,12.76 v12.6,14.3
R-18V
  Top 0.5: R19.P$1 1.65,5.22 1.3,4.87
  pour Top (no thermals): 1.95,5.45 1.95,4.55 0,4.55 0,5.45
R-33V
  Top 0.5: R19.P$2 0.65,6.65 1,7
  pour Top (no thermals): 0,7.45 1.95,7.45 1.95,6.55 0,6.55
RESET  (via drill 0.25 pad 0.25)
  Top 0.152: U1.RESET 8.2,21.75 8.05,21.9 8.05,23.03 7.87,23.22 7.04,23.22 | 7.04,23.22 7.16,23.33 7.16,24.39 U12.RESET | 7.04,23.22 4.86,23.22 4.47,22.83 4.47,22.1 4.22,21.86 v3.62,21.86 v3.62,21.85
  pour Top: 0,22.15 4,22.15 4,21.55 0,21.55
  pour Top (no thermals): 7.05,24.55 7.6,24.55 7.6,24.32 7.05,24.32
RXD-G  (via drill 0.25 pad 0.25)
  Top 0.152: U2.RXD 11.75,28.5 v11.95,28.3 | U1.PA24 9.75,23.28 9.54,23.49 9.16,23.49 v8.65,24
  Bottom 0.152: v8.65,24 8.65,24.59 8.27,24.96 8.27,26.35 9.61,27.69 10.38,27.69 10.99,28.3 v11.95,28.3
SC-18V
  Top 0.152: R14.P$1 3.85,4.9 3.85,3.59 | 2.5,1.23 2.61,1.13
  Top 0.2: U8.A1 3.75,5.2 R14.P$1 | 3.85,3.59 3.85,3.24 2.92,2.31 2.7,2.31 2.51,2.12 2.51,1.24 2.5,1.23
  pour Top (no thermals): 2,2 3,2 3,0 2,0
SC-33V
  Top 0.152: R17.P$1 3.85,11.1 3.85,12.41
  Top 0.2: U8.B1 3.75,10.8 R17.P$1 | 3.85,12.41 3.85,12.69 2.87,13.67 2.64,13.67 2.5,13.81 2.5,15.03 2.6,15.13
  pour Top (no thermals): 3,16 3,14 2,14 2,16
SCL-SAM  (via drill 0.25 pad 0.25)
  Top 0.152: U3.A0 14.8,15.2 v14.73,15.28 | v14.9,19.8 14.9,19.83 14.42,20.31 13.48,20.31 U1.PA09
  Bottom 0.152: v14.73,15.28 14.76,15.3 14.76,16.4 14.53,16.63 14.53,19.36 14.9,19.73 v14.9,19.8
SCL-SI
  Top 0.152: U11.SCL 13.09,13 13.35,12.74 | 13.35,12.74 13.9,12.19 14.34,12.19 15.02,12.87 17.56,12.87 17.73,13.03 18.42,13.03 18.75,12.71 U15.SCL | U3.B0 14.4,13.41 14.31,13.32 13.81,13.32 13.35,12.86 13.35,12.74
SCLK  (via drill 0.25 pad 0.25)
  Top 0.152: U7.SCLK 14.76,30.54 14.76,28.45 14.61,28.3 13.6,28.3 13.35,28.05 v13.35,27.8 | U1.PA19 11.25,23.31 12.39,24.45 v12.55,24.45
  Top 0.25: U7.SCLK 15.43,32.17 v15.3,32.3
  Bottom 0.152: v12.55,24.45 12.52,24.48 12.52,25.48 12.86,25.82 12.86,26.13 13.54,26.82 13.54,27.61 v13.35,27.8
  pour Bottom (no thermals): 14.55,32.7 15.7,32.7 15.7,30.6 14.55,30.6
SD-18V
  Top 0.2: U8.A2 4.49,6.21 4.49,4.14 R16.P$1 4.35,1.28 4.13,1.06
  pour Top (no thermals): 3.6,0 3.6,2 5,2 5,0
SD-33V
  Top 0.2: U8.B2 4.49,9.79 4.49,11.86 R18.P$1 4.35,14.88 4.16,15.07
  pour Top (no thermals): 3.6,16 3.6,14 5,14 5,16
SDA-SAM  (via drill 0.25 pad 0.25)
  Top 0.152: v14.05,15.28 14.07,15.22 14.42,14.87 14.42,14.68 U3.A1 | U1.PA08 14.15,19.75 v14.2,19.8
  Bottom 0.152: v14.05,15.28 14.05,15.38 14.41,15.74 14.41,16.25 14.2,16.47 v14.2,19.8
SDA-SI  (via drill 0.25 pad 0.25)
  Top 0.152: U15.SDA 18.75,13.79 18.34,13.38 17.56,13.38 17.4,13.21 14.77,13.21 14.31,12.75 v14.11,12.75 | U11.SDA 13.1,13.5 v13.23,13.62 13.35,13.74 U3.B1
  Bottom 0.152: v13.23,13.62 v14.1,12.75 v14.11,12.75
SWCLK  (via drill 0.25 pad 0.25)
  Top 0.152: U1.PA30 7.85,19.25 v7.75,19.15 7.96,18.94 7.96,17.8 8.2,17.55 R10.P$1
  Bottom 0.152: v3.62,20.85 v3.63,20.84 4.18,20.84 4.39,21.05 4.39,21.29 4.86,21.76 6.4,21.76 6.61,21.56 6.61,20.57 7.75,19.42 v7.75,19.15
  pour Top: 0,21.15 4,21.15 4,20.55 0,20.55
SWDIO  (via drill 0.25 pad 0.25)
  Top 0.152: U1.PA31 8.57,18.12 v8.5,18.05
  Bottom 0.152: v3.62,19.85 4.45,19.85 4.85,20.25 6.26,20.25 6.42,20.08 6.48,20.03 7.22,19.29 7.22,18.95 8.12,18.05 v8.5,18.05
  pour Top: 0,20.15 4,20.15 4,19.55 0,19.55
SWITCH
  pour Bottom: 20,25.2 17.75,25.2 17.75,27 20,27
TXD-G  (via drill 0.25 pad 0.25)
  Top 0.152: U1.PA23 10.25,23.48 9.73,24 v9.5,24 | v12.1,28.99 U2.TXD
  Bottom 0.152: v9.5,24 9.5,24.2 8.61,25.1 8.61,26.21 9.75,27.35 10.56,27.35 11,27.79 12.16,27.79 12.45,28.08 12.45,28.64 v12.1,28.99
VBATT+  (via drill 0.25 pad 0.25)
  Top 0.152: C28.P$2 16.77,4.35 | 18,4.26 L4.P$1 | U16.EN 17.57,21.65 v17.12,22.1
  Top 0.24: U17.VIN 16.3,4.65 | U16.VIN 18.4,22.4 18.53,22.4 v18.58,22.45
  Top 0.25: 16.3,4.65 C28.P$2 | 19.32,23.63 L5.P$1 19.3,22.78 | 19.3,22.29 C6.P$2 19.3,22.28 | 19.3,22.28
  Top 0.4: L4.P$1 19.11,4.33 19.32,4.56 v19.32,7.75 | v19.32,18.9 19.35,18.87 R6.P$2
  Top 0.6: 16.77,4.35 18,4.35 L4.P$1 | 19.3,22.78 19.3,22.53 | 19.3,22.53 19.3,22.28 | v18.58,22.45 19.22,22.45 19.3,22.53
  Bottom 0.25: 18,22.55 18,23.15
  Bottom 0.3: v18.58,22.45 18.5,22.33 17.36,22.33 v17.12,22.1
  Bottom 0.4: v19.32,7.75 19.4,7.83 19.4,18.82 v19.32,18.9 19.32,22.5
  pour Bottom: 20,24.75 17.75,24.75 17.75,22.25 20,22.25
XIN32
  Top 0.2: 9.25,17.93 U1.PA00
  Top 0.25: U14.CLK 9.46,17.3 9.25,17.51 U1.PA00 | U1.PA00

### Text on the board
tPlace: HV | C | D | LV | C | D
bPlace: + | TT7B | 1.5V | - | IN
tDocu: Pressure Sensor (2) | SCLK | MOSI | MISO | 1.8V-S | GND | CS2 | Pressure Sensor (1) | Program. SLOT | (PCI-Express) | Batt+ | VTref | Jumper | RESET | SWCLK | Thermistor (1) | AAA | SWDIO | GND | Thermistor (2) | Level Shifter | 1.5V LDO | Batt-